# EAGLE design MCP9808 breakout (EAGLE 7.3.0)
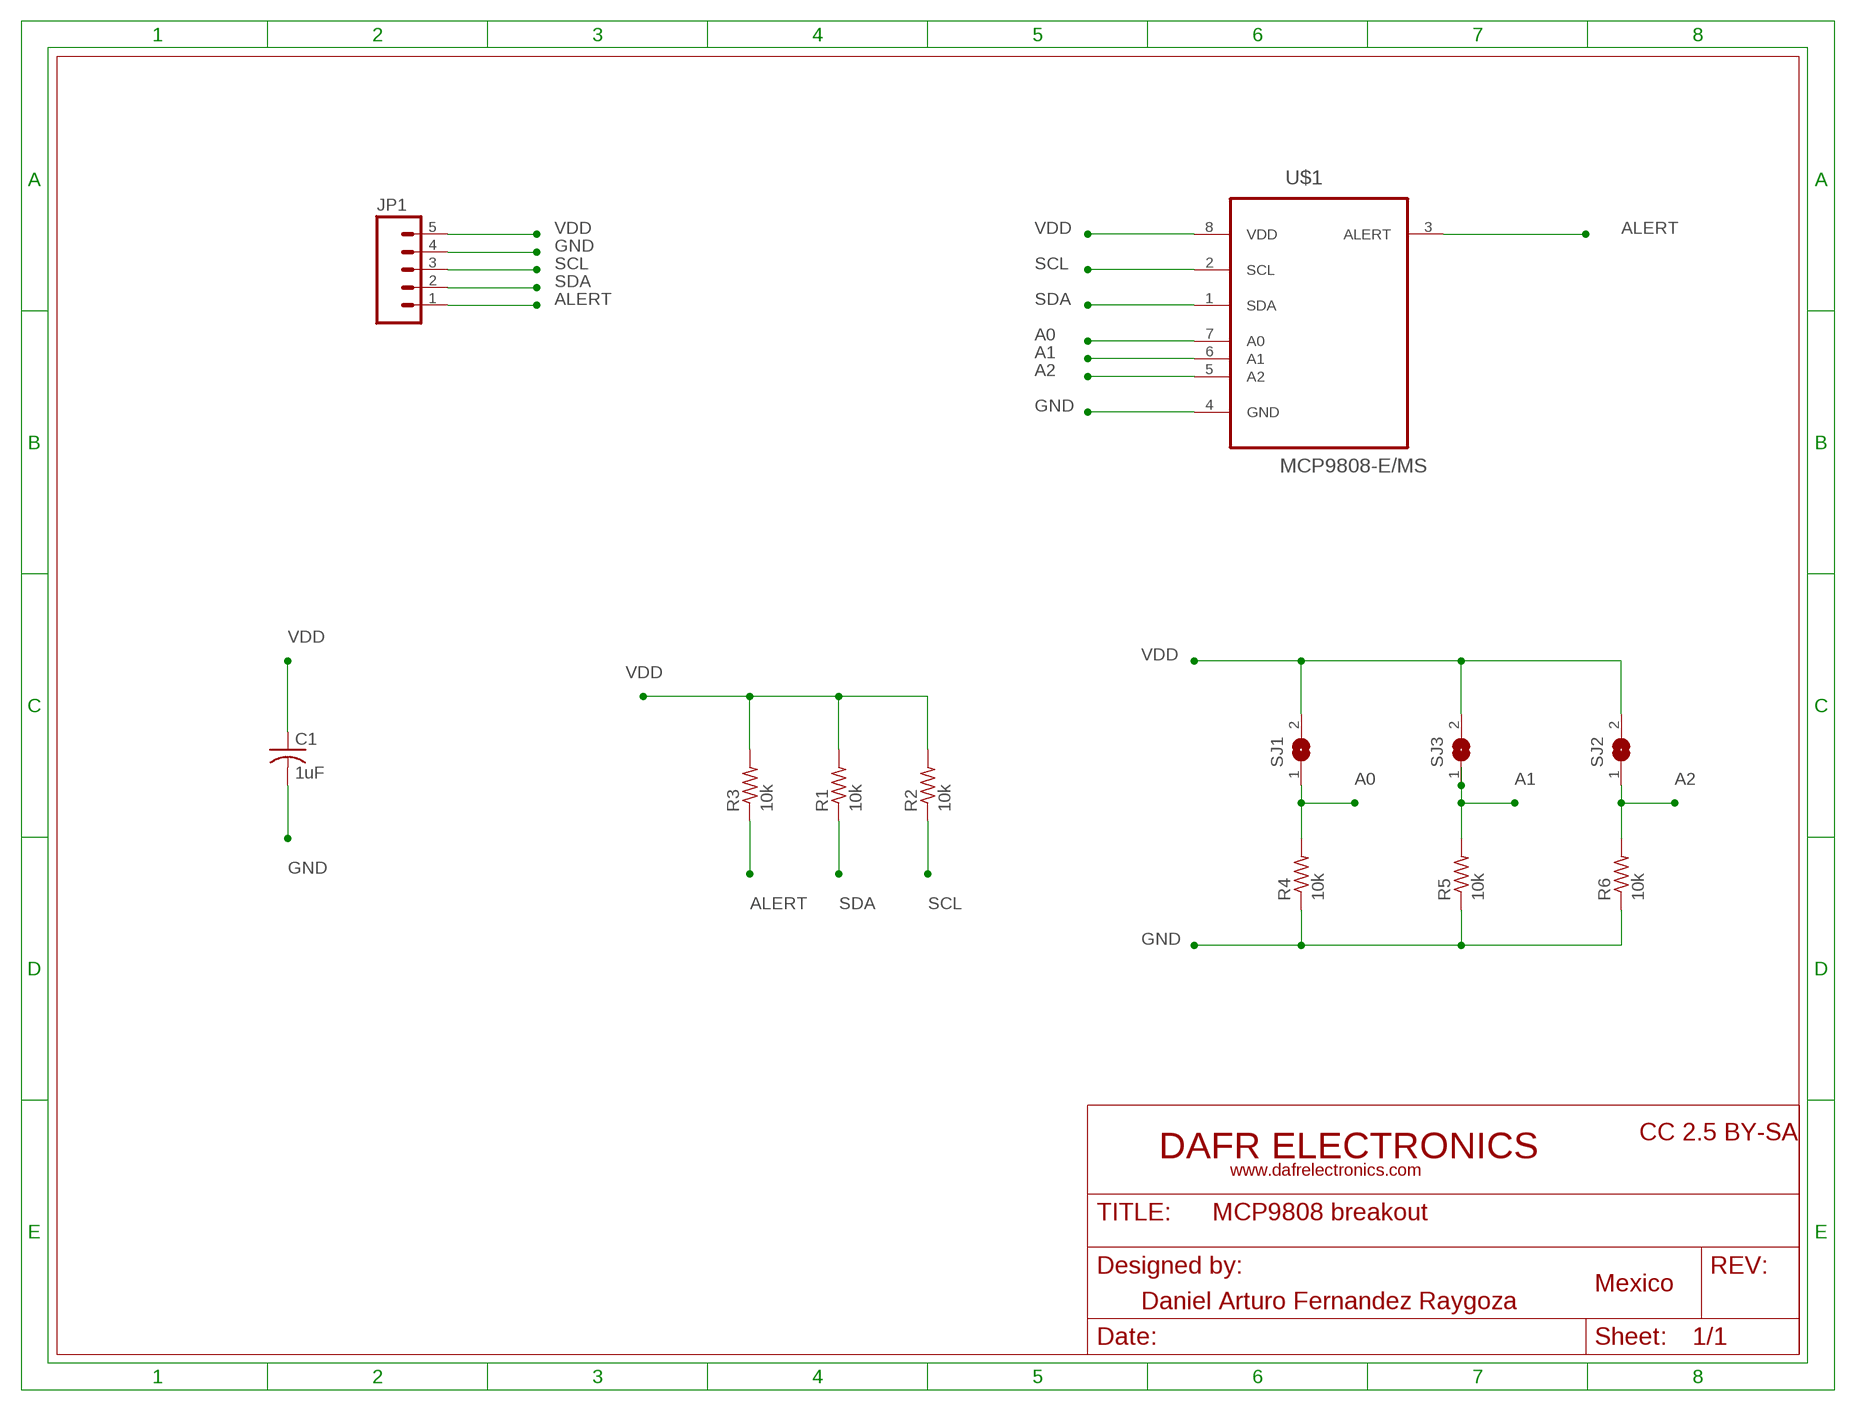
[diagram p0: schematic, sheet 1]

## Parts
C1  1uF  C-USC0603K  [C0603K]
JP1  M05NO_SILK  [1X05_NO_SILK]
R1  10k  R-US_R0805  [R0805]
R2  10k  R-US_R0805  [R0805]
R3  10k  R-US_R0805  [R0805]
R4  10k  R-US_R0805  [R0805]
R5  10k  R-US_R0805  [R0805]
R6  10k  R-US_R0805  [R0805]
SJ1  SJ  [SJ]
SJ2  SJ  [SJ]
SJ3  SJ  [SJ]
U$1  MCP9808-E/MS  [SOP65P490X110-8N]

## Nets
A0: R4.2 SJ1.1 U$1.7(A0)
A1: R5.2 SJ3.1 U$1.6(A1)
A2: R6.2 SJ2.1 U$1.5(A2)
ALERT: JP1.1 R3.1 U$1.3(ALERT)
GND: C1.2 JP1.4 R4.1 R5.1 R6.1 U$1.4(GND)
SCL: JP1.3 R2.1 U$1.2(SCL)
SDA: JP1.2 R1.1 U$1.1(SDA)
VDD: C1.1 JP1.5 R1.2 R2.2 R3.2 SJ1.2 SJ2.2 SJ3.2 U$1.8(VDD)

## Library data of the parts
C1 = adafruit:C-US: CAPACITOR, American symbol
JP1 = SparkFun-Connectors:M05: Header 5 Standard 5-pin 0.1" header. Use with straight break away headers (SKU : PRT-00116), right angle break away headers (PRT-00553), swiss pins (PRT-00743), machine pins (PRT-00117), and female headers (PRT-00115). Molex polarized connector foot print use with SKU : PRT-08230 with associated crimp pins and housings.
R1-R6 = adafruit:R-US_: RESISTOR, American symbol
SJ1-SJ3 = jumper:SJ: SMD solder JUMPER
U$1 = MCP9808:MCP9808-E/MS: Digital Temperature Sensor,MSOP-8; MPN: MCP9808-E/MS; OC_FARNELL: 2080523; OC_NEWARK: 89T8871; PACKAGE: MSOP-8; SUPPLIER: MICROCHIP

## Board
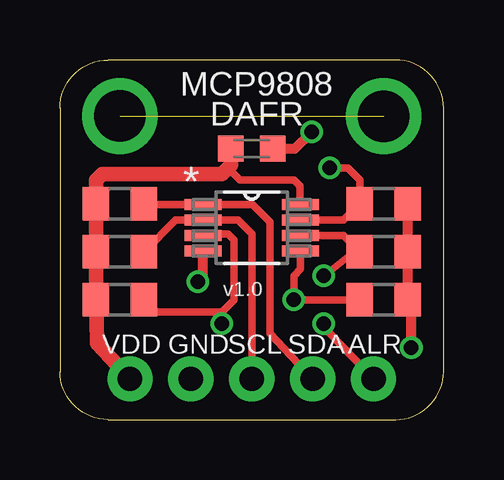
[diagram p1: board, top side]
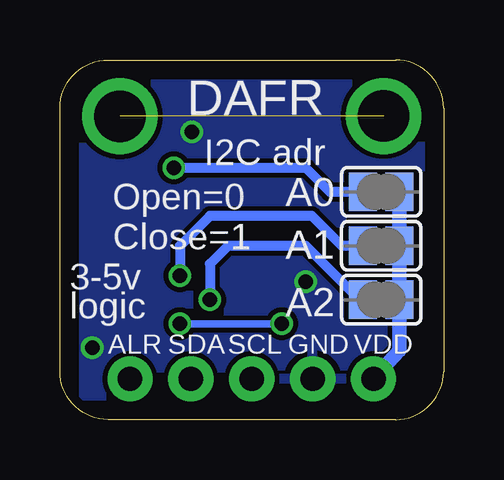
[diagram p2: board, bottom side, seen from below]

Size 16 x 15 mm. Coordinates in mm from the lower left corner, seen from the top.
Outline: 2,0 14,0 arc90 16,2 16,13 arc90 14,15 2,15 arc90 0,13 0,2 arc90 2,0
Copper layers (1*16): Top 0.0356mm / dielectric 1.5011mm / Bottom 0.0356mm
Design rules "LaenPCBOrder *": minimum track width 6mil, minimum drill 13mil, track to track 6mil, track to pad 6mil, pad to pad 6mil, via to via 6mil, smd to smd 6mil, copper to edge 15mil, drill to drill 6mil, minimum pad ring 7mil, minimum via ring 7mil, stop-mask expansion 3mil, vias tented up to drill 30mil, thermal gap 10mil

### Footprints (pad centres in the part's own frame; a part is rotated, then mirrored left to right if it is on the bottom)
C0603K = smd 1.05 x 1.08: 1 -0.875,0; 2 0.875,0
1X05_NO_SILK = drill 1.016 pad 1.88: 1 0,0; 2 2.54,0; 3 5.08,0; 4 7.62,0; 5 10.16,0
R0805 = smd 1.1 x 1.4: 1 -1,0; 2 1,0
SJ = smd 1.168 x 1.6: 1 -0.762,0; 2 0.762,0
SOP65P490X110-8N = smd 1.524 x 0.457: 1 -2.032,0.965; 2 -2.032,0.33; 3 -2.032,-0.33; 4 -2.032,-0.965; 5 2.032,-0.965; 6 2.032,-0.33; 7 2.032,0.33; 8 2.032,0.965

### Placement (x,y rotation side)
C1  8,11.3 0 top
JP1  13.08,1.7 180 top
R1  2.5,9 180 top
R2  2.5,7 180 top
R3  2.5,5 180 top
R4  13.5,9 180 top
R5  13.5,7 180 top
R6  13.5,5 180 top
SJ1  2.6,9.5 0 bottom
SJ2  2.6,5 0 bottom
SJ3  2.6,7.25 0 bottom
U$1  8,8 0 top

### Tracks (layer width: path | path; a pad name or v marks a point on that pad's centre or on a via)
A0  (via drill 0.6)
  Top 0.305: U$1.7 11.83,8.33 R4.2 12.5,10 12,10.5 v11.25,10.5
  Bottom 0.406: SJ1.1 4.75,9.5 5.75,10.5 v11.25,10.5
A1  (via drill 0.6)
  Top 0.305: U$1.6 11.83,7.67 R5.2 12.25,7 v11,6
  Bottom 0.406: SJ3.1 4.25,7.25 5.5,8.5 9.75,8.5 11,7.25 v11,6
A2  (via drill 0.6)
  Top 0.305: 10.5,7 10.07,7 U$1.5 10.03,6.28 9.75,6 v9.75,5 R6.2
  Bottom 0.406: SJ2.1 3.5,5 5.75,7.25 9,7.25 9.75,6.5 v9.75,5
ALERT  (via drill 0.6)
  Top 0.305: U$1.3 6.05,7.75 7,7.75 7.25,7.5 7.25,5 6.75,4.5 | JP1.1 10.88,4 v11,4 | R3.1 4,4.5 6.75,4.5 | v6.75,4 6.75,4.5
  Bottom 0.305: v11,4 v6.75,4
GND  (via drill 0.6)
  Top 0.406: v5.75,5.75 5.97,5.97 U$1.4 6,7 | R4.1 R5.1 R6.1 14.65,4.85 v14.65,3 | C1.2 9.8,11.3 v10.5,12
  pour Bottom (isolate 0.2): 1,14 1,1 15,1 15,14
N$1  (via drill 2.15)  (1 unrouted)
  other vias: 2.5,12.66 13.5,12.65
SCL
  Top 0.305: JP1.3 8,7.75 7.42,8.33 U$1.2 4.83,8.33 R2.1
SDA
  Top 0.305: JP1.2 8.75,3.59 8.75,8.25 8.04,8.96 U$1.1 | U$1.1 5.93,9 | 3.79,8.96 3.8,8.95 R1.1 | 3.75,9 3.79,8.96 | 3.79,8.96 U$1.1
VDD
  Top 0.305: U$1.8 10,9 10,9.75 9.75,10 7.5,10 7.12,10.38 6.88,10.38
  Top 0.61: JP1.5 1.55,3.17 R3.2 R2.2 R1.2 1.5,10 1.75,10.25 6.75,10.25 6.88,10.38 7.12,10.62 C1.1
  Bottom 0.61: SJ1.2 SJ3.2 SJ2.2 1.84,2.88 JP1.5

### Text on the board
tPlace: MCP9808 | DAFR | v1.0 | VDD | GND | SCL | SDA | ALR
bPlace: DAFR | I2C adr | A0 | A1 | Open=0 / Close=1 | A2 | 3-5v / logic | VDD | GND | SCL | SDA | ALR